# EAGLE design rev1_header_done (EAGLE 9.5.1)
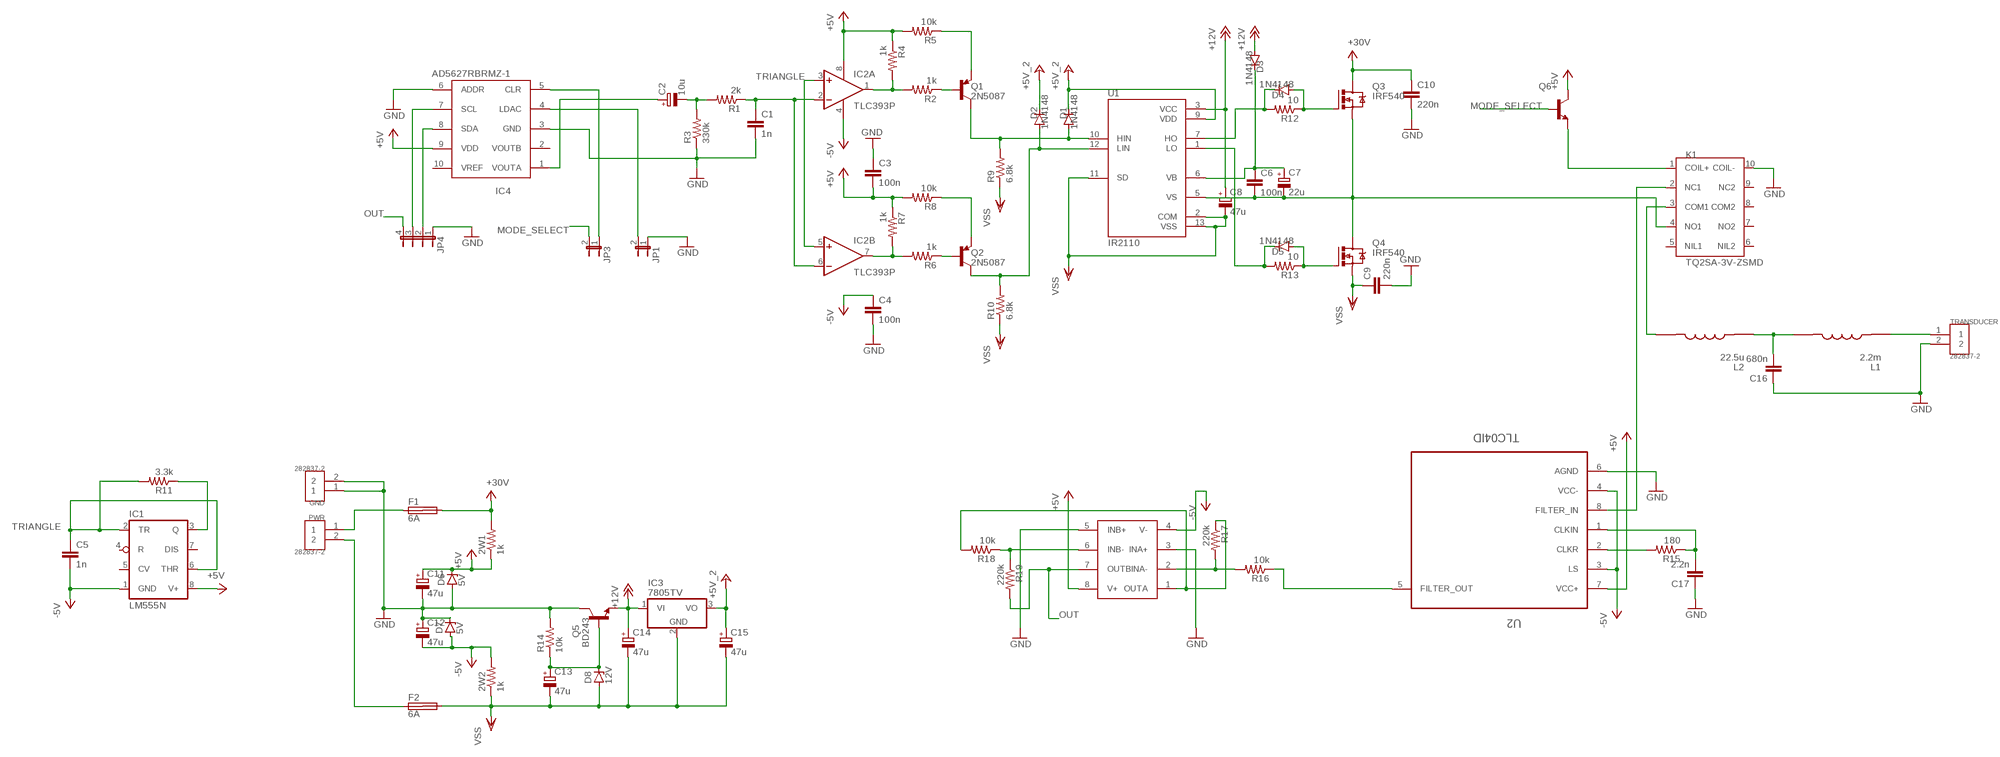
[diagram p0: schematic, sheet 1]

## Parts
2W1  1k  R-US_V235/17  [V235/17]
2W2  1k  R-US_V235/17  [V235/17]
C1  1n  C-EU050-025X075  [C050-025X075]
C2  10u  CPOL-EUE2,5-6E  [E2,5-6E]
C3  100n  C-EU050-025X075  [C050-025X075]
C4  100n  C-EU050-025X075  [C050-025X075]
C5  1n  C-EU050-025X075  [C050-025X075]
C6  100n  C-EU050-025X075  [C050-025X075]
C7  22u  CPOL-EUE2,5-6E  [E2,5-6E]
C8  47u  CPOL-EUE2,5-6E  [E2,5-6E]
C9  220n  C-EU050-025X075  [C050-025X075]
C10  220n  C-EU050-025X075  [C050-025X075]
C11  47u  CPOL-EUE2,5-6E  [E2,5-6E]
C12  47u  CPOL-EUE2,5-6E  [E2,5-6E]
C13  47u  CPOL-EUE2,5-6E  [E2,5-6E]
C14  47u  CPOL-EUE2,5-6E  [E2,5-6E]
C15  47u  CPOL-EUE2,5-6E  [E2,5-6E]
C16  680n  C-EU050-025X075  [C050-025X075]
C17  2.2n  C-EU050-025X075  [C050-025X075]
D1  1N4148  1N4148DO35-7  [DO35-7]
D2  1N4148  1N4148DO35-7  [DO35-7]
D3  1N4148  1N4148DO35-7  [DO35-7]
D4  1N4148  1N4148DO35-7  [DO35-7]
D5  1N4148  1N4148DO35-7  [DO35-7]
D6  5V  1N4728  [DO41Z10]
D7  5V  1N4728  [DO41Z10]
D8  12V  1N4728  [DO41Z10]
F1  6A  SHK20L  [SHK20L]
F2  6A  SHK20L  [SHK20L]
GND  282837-2  [TE_282837-2]
IC1  LM555N  [DIL08]
IC2  TLC393P  [DIL08]
IC3  7805TV  [TO220V]
IC4  AD5627RBRMZ-1  [SOP50P490X110-10N]
IC5  OP2177CRMZ  [SOP65P490X110-8N]
JP1  JP1E  [JP1]
JP3  JP1E  [JP1]
JP4  JP4E  [JP4]
K1  TQ2SA-3V-ZSMD  [TQ2SA-3V-Z]
L1  2.2m  LQH43NN222K03L  [IND_LQH43NN222K03L]
L2  22.5u  LQH43NN222K03L  [IND_LQH43NN222K03L]
PWR  282837-2  [TE_282837-2]
Q1  2N5087  [TO92]
Q2  2N5087  [TO92]
Q3  IRF540  [TO220BV]
Q4  IRF540  [TO220BV]
Q5  BD243  [TO220]
Q6  -NPN-TO92  [TO92]
R1  2k  R-US_V234/12  [V234/12]
R2  1k  R-US_V234/12  [V234/12]
R3  330k  R-US_V234/12  [V234/12]
R4  1k  R-US_V234/12  [V234/12]
R5  10k  R-US_V234/12  [V234/12]
R6  1k  R-US_V234/12  [V234/12]
R7  1k  R-US_V234/12  [V234/12]
R8  10k  R-US_V234/12  [V234/12]
R9  6.8k  R-US_V234/12  [V234/12]
R10  6.8k  R-US_V234/12  [V234/12]
R11  3.3k  R-US_V234/12  [V234/12]
R12  10  R-US_V234/12  [V234/12]
R13  10  R-US_V234/12  [V234/12]
R14  10k  R-US_V234/12  [V234/12]
R15  180  R-US_V234/12  [V234/12]
R16  10k  R-US_V234/12  [V234/12]
R17  220k  R-US_V234/12  [V234/12]
R18  10k  R-US_V234/12  [V234/12]
R19  220k  R-US_V234/12  [V234/12]
TRANSDUCER  282837-2  [TE_282837-2]
U1  IR2110  [DIP762W45P254L2019H533Q14]
U2  TLC04ID  [SOIC127P600X175-8N]

## Nets
+5V: 2W1.1 C3.2 C11.+ D6.C IC1.8(V+) IC2.8(P:V+) IC4.9(VDD) IC5.8(V+) Q6.3(C) R4.1 R5.2 R7.1 R8.2 U2.7(VCC+)
+5V_2: C15.+ D1.C D2.C IC3.3(VO) U1.9(VDD)
+12V: C8.+ C14.+ D3.A IC3.1(VI) Q5.3(E) U1.3(VCC)
-5V: 2W2.2 C4.1 C5.2 C12.- D7.A IC1.1(GND) IC2.4(P:V-) IC5.4(V-) U2.3(LS) U2.4(VCC-)
CLR: IC4.5(CLR) JP3.1
GND: C1.2 C3.1 C4.2 C9.2 C10.2 C11.- C12.+ C16.1 C17.1 D6.A D7.C GND.1 GND.2 IC4.3(GND) IC4.6(ADDR) IC5.3(INA+) IC5.5(INB+) JP1.1 JP4.1 K1.10(COIL-) Q5.2(C) R3.1 R14.2 TRANSDUCER.2 U2.6(AGND)
H_GATE: D4.A Q3.G R12.1
L_GATE: D5.A Q4.G R13.1
LDAC: IC4.4(LDAC) JP1.2
MODE_SELECT: JP3.2 Q6.2(B)
N$1: C2.+ IC4.1(VOUTA)
N$2: C2.- R1.2 R3.2
N$3: C1.1 IC2.2(A:-IN) IC2.6(B:-IN) R1.1
N$4: IC2.1(A:OUT) R2.2 R4.2
N$5: Q1.2(B) R2.1
N$6: Q1.3(E) R5.1
N$7: IC2.7(B:OUT) R6.2 R7.2
N$8: Q2.3(E) R8.1
N$9: Q2.2(B) R6.1
N$10: D1.A Q1.1(C) R9.2 U1.10(HIN)
N$11: D2.A Q2.1(C) R10.2 U1.12(LIN)
N$12: IC1.3(Q) R11.1
N$13: C6.1 C7.+ D3.C U1.6(VB)
N$16: C16.2 L1.2 L2.1
N$17: D4.C R12.2 U1.7(HO)
N$20: D5.C R13.2 U1.1(LO)
N$21: K1.3(COM1) L2.2
N$22: K1.1(COIL+) Q6.1(E)
N$24: L1.1 TRANSDUCER.1
N$25: F1.1A PWR.1
N$26: F2.1A PWR.2
N$28: C13.+ D8.C Q5.1(B) R14.1
N$29: K1.2(NC1) U2.8(FILTER_IN)
N$31: R15.2 U2.2(CLKR)
N$32: C17.2 R15.1 U2.1(CLKIN)
N$33: R16.1 U2.5(FILTER_OUT)
N$34: IC5.2(INA-) R16.2 R17.2
N$35: IC5.1(OUTA) R17.1 R18.2
N$36: IC5.6(INB-) R18.1 R19.1
OUT: IC5.7(OUTB) JP4.4 R19.2
SCL: IC4.7(SCL) JP4.3
SDA: IC4.8(SDA) JP4.2
TRANSMIT: C6.2 C7.- K1.4(NO1) Q3.S Q4.D U1.5(VS)
TRIANGLE: C5.1 IC1.2(TR) IC1.6(THR) IC2.3(A:+IN) IC2.5(B:+IN) R11.2
V+: 2W1.2 C10.1 F1.2A Q3.D ; supply symbol labelled +30V
VSS: 2W2.1 C8.- C9.1 C13.- C14.- C15.- D8.A F2.2A IC3.2(GND) Q4.S R9.1 R10.1 U1.2(COM) U1.11(SD) U1.13(VSS)
Unconnected: F1.1B F1.2B F2.1B F2.2B IC1.4(R) IC1.5(CV) IC1.7(DIS) IC4.2(VOUTB) IC4.10(VREF) K1.5(NIL1) K1.6(NIL2) K1.7(NO2) K1.8(COM2) K1.9(NC2)

## Library data of the parts
2W1 2W2 R1-R19 = rcl:R-US_: RESISTOR, American symbol; SPICEPREFIX: R
C1 C3-C6 C9 C10 C16 C17 = rcl:C-EU: CAPACITOR, European symbol; SPICEPREFIX: C
C2 C7 C8 C11-C15 = rcl:CPOL-EU: POLARIZED CAPACITOR, European symbol; SPICEPREFIX: C
D1-D5 = diode:1N4148: DIODE high speed (Philips)
D6-D8 = diode:1N4728: Z DIODE 3.3 V, 1W, 5 percent
F1 F2 = fuse:SHK20L: FUSE HOLDER 5 x 20 mm, SH contact, SHH1 Schukat, E1073 Buerklin; OC_FARNELL: unknown; OC_NEWARK: unknown
GND PWR TRANSDUCER = 282837-2:282837-2: TERM BLOCK 5.08MM 2POS SIDE ENTY; AVAILABILITY: Unavailable; COMMENT: 282837-2; DESCRIPTION: Connector Terminal Blocks Receptacle 2 Position 5.08mm Solder Straight Thru-Hole 13.5A/Contact; MF: TE Connectivity; MP: 282837-2; PACKAGE: None; PRICE: None; TE_PURCHASE_URL: https://www.te.com/usa-en/product-282837-2.html?te_bu=Cor&te_type=disp&te_campaign=seda_glo_cor-seda-global-disp-prtnr-fy19-seda-model-bom-cta_sma-317_1&elqCampaignId=32493
IC1 = linear:*555: TIMER
IC2 = linear:TLC393: COMPARATOR
IC3 = linear:78*: Positive VOLTAGE REGULATOR Source: http://cache.national.com/ds/LM/LM78L05.pdf http://www.fairchildsemi.com/ds/LM/LM7805.pdf
IC4 = SOP50P490X110-10N:AD5627RBRMZ-1
IC5 = OP2177CRMZ:OP2177CRMZ
JP1 JP3 = jumper:JP1E: JUMPER
JP4 = jumper:JP4E: JUMPER
K1 = TQ2SA-3V-Z:TQ2SA-3V-Z: 5mm Low profile, 2 Form C relay
L1 L2 = LQH43NN222K03L:LQH43NN222K03L: Inductor Power Chip Unshielded Wirewound 2200uH 5% 1KHz 40Q-Factor Ferrite 0.03A 36.72Ohm DCR 1812 Automotive T/R; AVAILABILITY: Unavailable; DESCRIPTION: Inductor with Inductance: 2200uH Tol. +/-10%, Package: 1812 _4532_; MF: Murata; MP: LQH43NN222K03L; PACKAGE: NONSTANDARD; PRICE: None
Q1 Q2 = transistor-pnp:2N5087: PNP Transistor
Q3 Q4 = transistor-power:IRF540: HEXFET Power MOSFET
Q5 = transistor:BD243: NPN TRANSISTOR Source: Motorola Semiconductor, Master Selection Guide Q3/95 SG73 REV 8 page 5.5-4
Q6 = transistor-neu-to92:*-NPN-: NPN Transistror
U1 = IR2110:IR2110: High and Low Side Driver, All High Voltage Pins On One Side, Separate Logic and Power Ground, Shut-Down; AVAILABILITY: Unavailable; DESCRIPTION: Half-Bridge Gate Driver IC Non-Inverting 14-DIP; MF: Infineon; MP: IR2110; PACKAGE: DIP-14 Infineon; PRICE: None
U2 = TLC04ID:TLC04ID: SWITCHED-CAPACITOR FILTERS; AVAILABILITY: Unavailable; DESCRIPTION: Active Filter Single SW-CAP Low Pass 4th Order 40kHz 8-Pin SOIC Tube; MF: Texas Instruments; MP: TLC04ID; PACKAGE: SOIC-8 Texas Instruments; PRICE: None

## Board
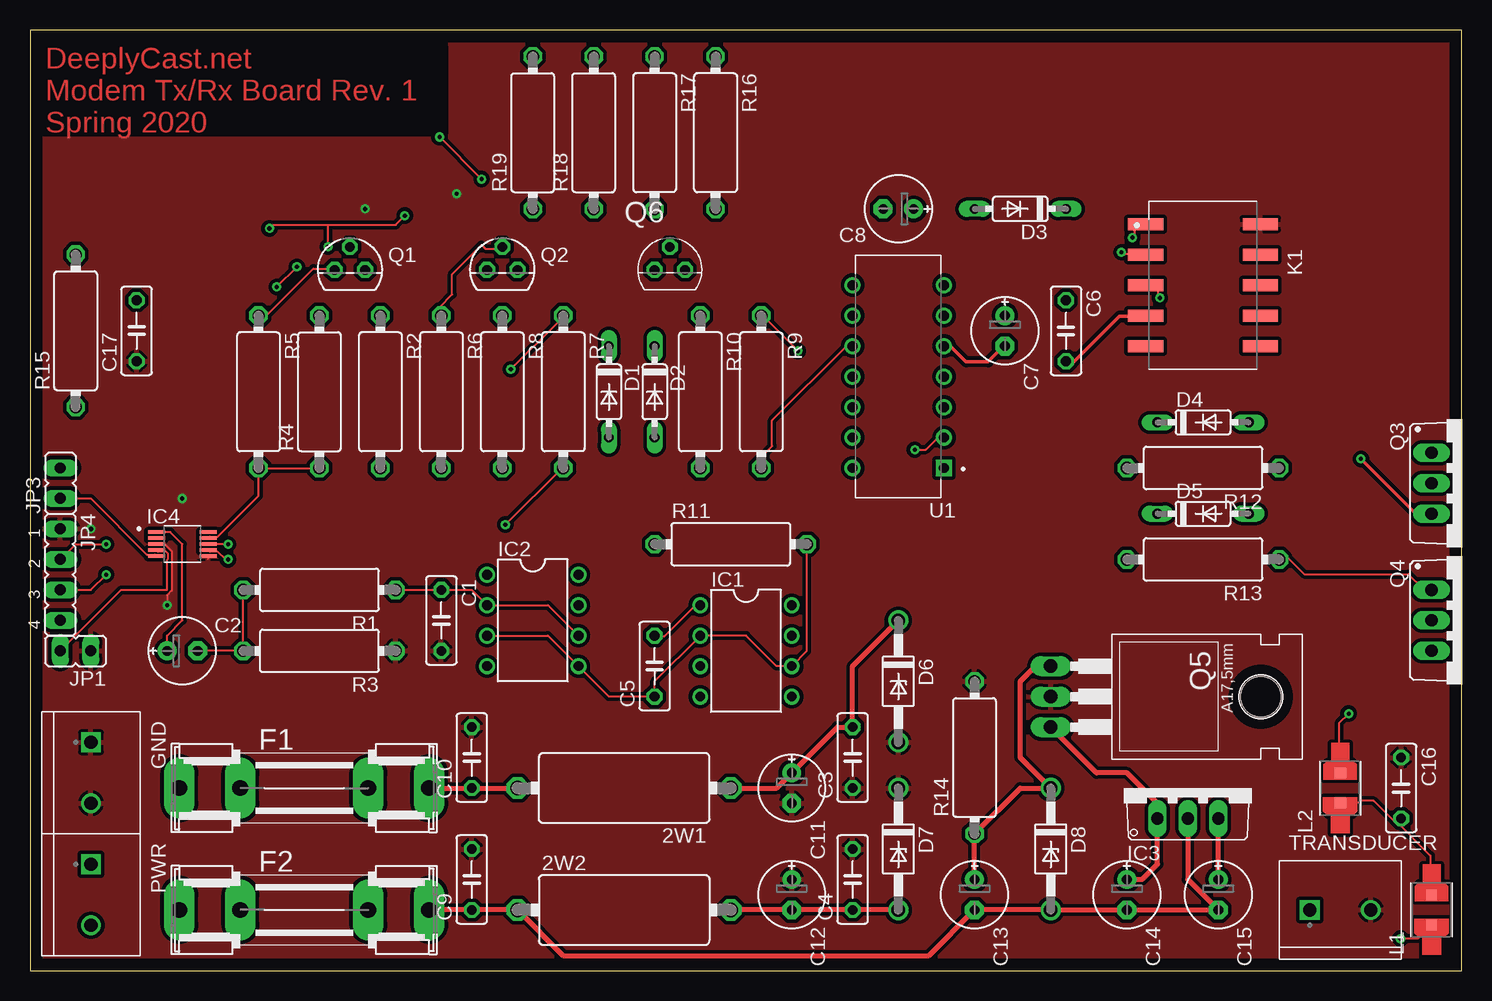
[diagram p1: board, top side]
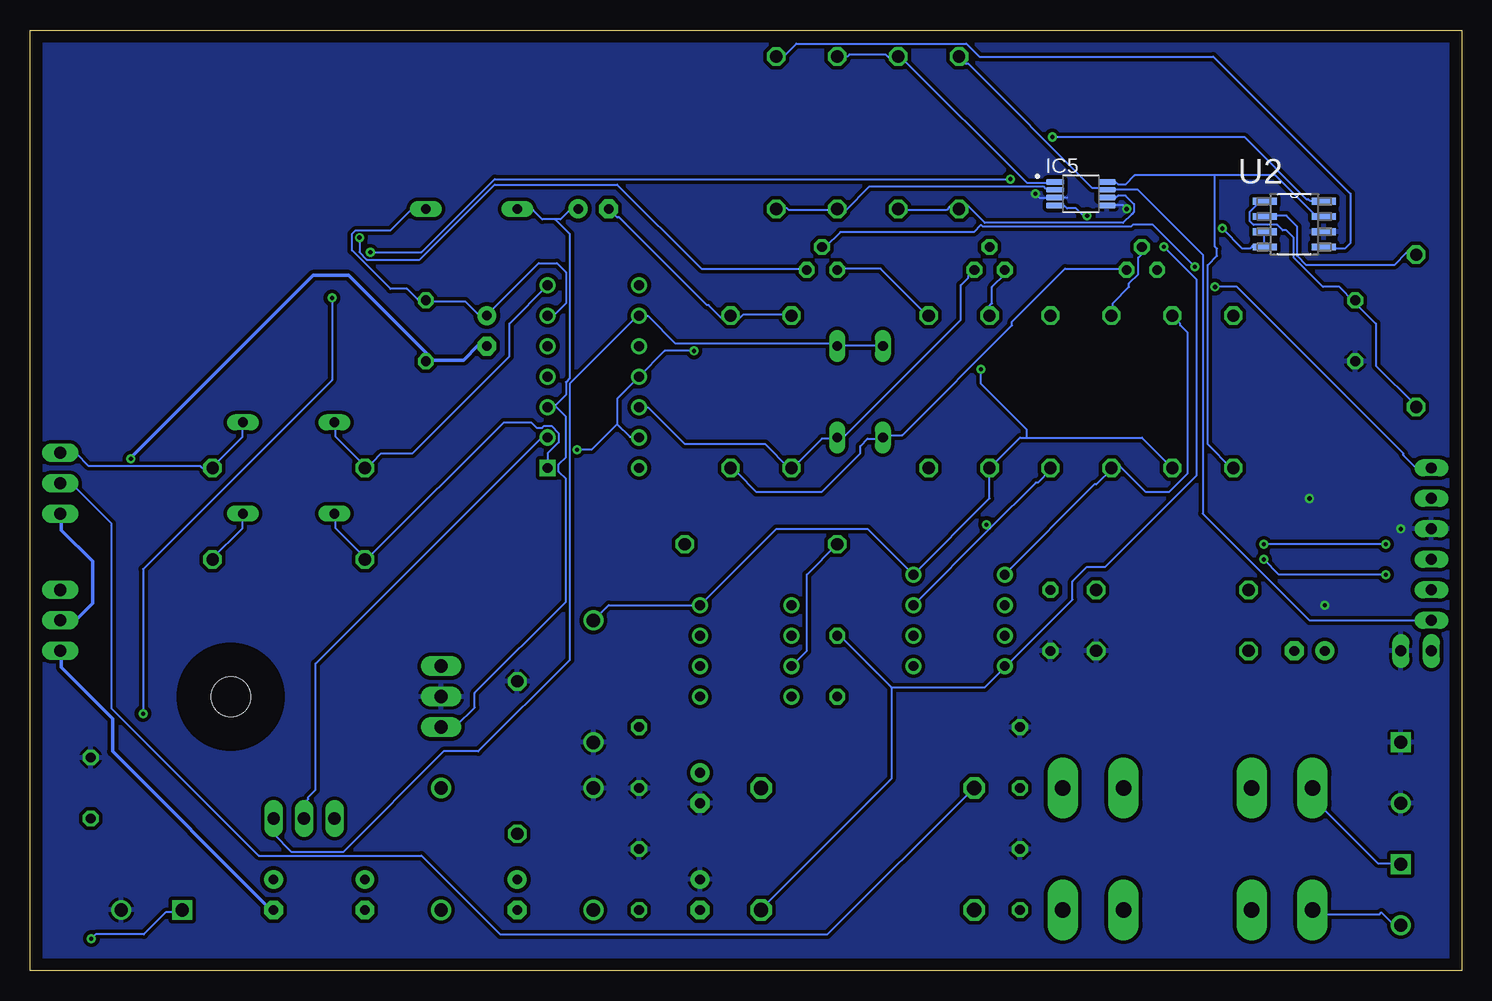
[diagram p2: board, bottom side, seen from below]

Size 119.36 x 78.41 mm. Coordinates in mm from the lower left corner, seen from the top.
Outline: 0,0 119.36,0 119.36,78.41 0,78.41 0,0
Copper layers (1*16): Top 0.035mm / dielectric 1.5mm / Bottom 0.035mm
Design rules "default": minimum track width 6mil, minimum drill 0.35mm, track to track 6mil, track to pad 6mil, pad to pad 6mil, via to via 6mil, smd to smd 6mil, copper to edge 40mil, drill to drill 6mil, minimum pad ring 10mil, minimum via ring 8mil, stop-mask expansion 4mil, vias tented up to drill 0mil, thermal gap 10mil

### Footprints (pad centres in the part's own frame; a part is rotated, then mirrored left to right if it is on the bottom)
V235/17 = drill 1.194 octagon: 1 -8.89,0; 2 8.89,0
C050-025X075 = drill 0.813 octagon: 1 -2.54,0; 2 2.54,0
E2,5-6E = drill 0.813 pad 1.575: + -1.27,0 | drill 0.813 pad 1.575 octagon: - 1.27,0
DO35-7 = drill 0.813 long: A 3.81,0; C -3.81,0
DO41Z10 = drill 1.118: A 5.08,0; C -5.08,0
SHK20L = drill 1.321 pad 2.54 long: 1A -10.414,0; 1B -5.334,0; 2A 10.414,0; 2B 5.334,0
TE_282837-2 = drill 1.1 square: 1 -2.54,0 | drill 1.1: 2 2.54,0
DIL08 = drill 0.813 pad 1.27: 1 -3.81,-3.81; 2 -1.27,-3.81; 3 1.27,-3.81; 4 3.81,-3.81; 5 3.81,3.81; 6 1.27,3.81; 7 -1.27,3.81; 8 -3.81,3.81
TO220V = drill 1.016 long: 1 -2.54,-2.54; 2 0,-2.54; 3 2.54,-2.54
SOP50P490X110-10N = smd 1.47 x 0.28: 1 -2.15,1; 2 -2.15,0.5; 3 -2.15,0; 4 -2.15,-0.5; 5 -2.15,-1; 6 2.15,-1; 7 2.15,-0.5; 8 2.15,0; 9 2.15,0.5; 10 2.15,1
SOP65P490X110-8N = smd 1.47 x 0.48: 1 -2.15,0.975; 2 -2.15,0.325; 3 -2.15,-0.325; 4 -2.15,-0.975; 5 2.15,-0.975; 6 2.15,-0.325; 7 2.15,0.325; 8 2.15,0.975
JP1 = drill 0.914 long: 1 0,-1.27; 2 0,1.27
JP4 = drill 0.914 long: 1 -3.81,0; 2 -1.27,0; 3 1.27,0; 4 3.81,0
TQ2SA-3V-Z = smd 1 x 2.94: 1 -5.08,-4.78; 2 -2.54,-4.78; 3 0,-4.78; 4 2.54,-4.78; 5 5.08,-4.78; 6 5.08,4.78; 7 2.54,4.78; 8 0,4.78; 9 -2.54,4.78; 10 -5.08,4.78
IND_LQH43NN222K03L = smd 0.9 x 0.9: 1 -1.25,0; 2 1.25,0
TO92 = drill 0.813 octagon: 1 1.27,0; 2 0,1.905; 3 -1.27,0
TO220BV = drill 1.016 long: D 0,-2.54; G -2.54,-2.54; S 2.54,-2.54
TO220 = drill 1.118 long: 1 -2.54,-6.35; 2 0,-6.35; 3 2.54,-6.35 | hole 3.302: 0,11.176
V234/12 = drill 1.016 octagon: 1 -6.35,0; 2 6.35,0
DIP762W45P254L2019H533Q14 = drill 0.83 pad 1.25 square: 1 -3.81,7.62 | drill 0.83 pad 1.25: 2 -3.81,5.08; 3 -3.81,2.54; 4 -3.81,0; 5 -3.81,-2.54; 6 -3.81,-5.08; 7 -3.81,-7.62; 8 3.81,-7.62; 9 3.81,-5.08; 10 3.81,-2.54; 11 3.81,0; 12 3.81,2.54; 13 3.81,5.08; 14 3.81,7.62
SOIC127P600X175-8N = smd 1.981 x 0.559: 1 -2.464,1.905; 2 -2.464,0.635; 3 -2.464,-0.635; 4 -2.464,-1.905; 5 2.464,-1.905; 6 2.464,-0.635; 7 2.464,0.635; 8 2.464,1.905

### Placement (x,y rotation side)
2W1  49.53,15.24 180 top
2W2  49.53,5.08 0 top
C1  34.29,29.21 270 top
C2  12.7,26.67 0 top
C3  68.58,17.78 90 top
C4  68.58,7.62 90 top
C5  52.07,25.4 90 top
C6  86.36,53.34 270 top
C7  81.28,53.34 270 top
C8  72.39,63.5 180 top
C9  36.83,7.62 90 top
C10  36.83,17.78 90 top
C11  63.5,15.24 270 top
C12  63.5,6.35 270 top
C13  78.74,6.35 270 top
C14  91.44,6.35 270 top
C15  99.06,6.35 270 top
C16  114.3,15.24 270 top
C17  8.89,53.34 90 top
D1  48.26,48.26 270 top
D2  52.07,48.26 270 top
D3  82.55,63.5 180 top
D4  97.79,45.72 0 top
D5  97.79,38.1 0 top
D6  72.39,24.13 270 top
D7  72.39,10.16 270 top
D8  85.09,10.16 270 top
F1  22.86,15.24 0 top
F2  22.86,5.08 0 top
GND  5.08,16.51 270 top
IC1  59.69,26.67 270 top
IC2  41.91,29.21 270 top
IC3  96.52,15.24 0 top
IC4  12.7,35.56 0 top
IC5  31.75,64.77 0 bottom
JP1  3.81,26.67 90 top
JP3  2.54,40.64 0 top
JP4  2.54,33.02 270 top
K1  97.79,57.15 270 top
L1  116.84,5.08 90 top
L2  109.22,15.24 90 top
PWR  5.08,6.35 270 top
Q1  26.67,58.42 0 top
Q2  39.37,58.42 0 top
Q3  119.38,40.64 270 top
Q4  119.38,29.21 270 top
Q5  91.44,22.86 270 top
Q6  53.34,58.42 0 top
R1  24.13,31.75 180 top
R2  29.21,48.26 270 top
R3  24.13,26.67 180 top
R4  24.13,48.26 90 top
R5  19.05,48.26 270 top
R6  34.29,48.26 270 top
R7  44.45,48.26 270 top
R8  39.37,48.26 270 top
R9  60.96,48.26 270 top
R10  55.88,48.26 270 top
R11  58.42,35.56 0 top
R12  97.79,41.91 180 top
R13  97.79,34.29 180 top
R14  78.74,17.78 90 top
R15  3.81,53.34 90 top
R16  57.15,69.85 270 top
R17  52.07,69.85 270 top
R18  46.99,69.85 90 top
R19  41.91,69.85 90 top
TRANSDUCER  109.22,5.08 0 top
U1  72.39,49.53 180 top
U2  13.97,62.23 0 bottom

### Tracks (layer width: path | path; a pad name or v marks a point on that pad's centre or on a via)
+5V  (via drill 0.35)
  Top 0.152: R4.1 R5.2 19.05,39.58 15.66,36.19 14.98,36.19 IC4.9 | v40.08,50.14 44.04,54.1 44.04,54.25 44.35,54.56 R7.1
  Top 0.406: 2W1.1 62.23,15.24 C11.+ 67.31,20.32 C3.2 68.58,25.4 D6.C
  Bottom 0.152: D6.C 71.12,30.48 IC1.8 57.15,36.83 49.53,36.83 IC2.8 39.37,39.37 R8.2 36.83,44.45 36.27,44.45 | 36.27,44.45 26.67,44.45 R4.1 | 20.57,66.29 15.54,66.29 12.19,62.94 11.58,62.94 U2.7 | 20.57,66.29 27.28,66.29 28.04,65.53 28.65,65.53 28.8,65.68 29.57,65.68 IC5.8 | Q6.3 51.97,58.52 48.46,58.52 44.5,54.56 R7.1 | v40.08,50.14 40.08,48.92 36.27,45.11 36.27,44.45 | 20.57,66.29 20.57,60.35 20.42,60.2 20.42,59.59 21.18,58.83 21.18,43.89 19.2,41.91 R5.2
+5V_2
  Top 0.406: C15.+ IC3.3
  Bottom 0.152: D1.C 48.31,52.12 51.97,52.12 D2.C 52.27,52.27 65.53,52.27 67.82,54.56 68.58,54.56 U1.9 68.58,54.71 74.37,48.92 74.37,25.91 81.99,18.29 84.89,18.29 93.27,9.91 97.54,9.91 99.06,11.43 IC3.3
+12V
  Top 0.406: C14.+ 92.71,7.62 93.98,8.89 IC3.1 93.98,13.97 91.44,16.51 88.9,16.51 Q5.3
  Bottom 0.152: 75.59,62.64 75.13,62.64 74.37,63.4 73.76,63.4 C8.+ | 75.59,62.64 76.66,62.64 77.42,63.4 78.64,63.4 D3.A | 75.59,47.09 76.2,47.09 U1.3 75.59,47.09 | 75.59,47.09 74.68,48.01 74.68,49.07 74.37,49.38 74.37,61.42 75.59,62.64 | 75.59,47.09 74.68,46.18 74.68,42.82 75.29,42.22 75.29,41.6 74.68,41 74.68,30.79 82.3,23.16 82.3,21.95 83.82,20.42 85.04,20.42 Q5.3
-5V  (via drill 0.35)
  Top 0.152: v31.24,62.94 30.48,62.18 24.84,62.18 | 24.84,62.18 20.27,62.18 v19.96,61.87 | IC1.1 55.47,30.48 52.88,27.89 52.12,27.89 C5.2 | v24.84,60.35 24.84,62.18
  Top 0.406: 2W2.2 C12.- C4.1 D7.A
  Bottom 0.152: v31.24,62.94 31.55,62.94 32.16,63.55 32.92,63.55 33.07,63.7 33.83,63.7 IC5.4 | v19.96,61.87 18.29,60.2 17.68,60.2 17.37,60.5 16.61,60.5 16.46,60.35 | 16.46,60.35 16.46,61.57 U2.3 | 16.46,60.35 U2.4 | 38.1,25.3 39.78,23.62 47.55,23.62 | 47.55,23.62 51.97,28.04 C5.2 | 47.55,23.62 47.55,16 58.37,5.18 2W2.2 | v24.84,60.35 22.1,57.61 22.1,41.3 29.72,33.68 31.24,33.68 32.46,32.46 32.46,30.94 38.1,25.3 | 38.1,25.3 IC2.4
CLR
  Top 0.152: IC4.5 10.42,34.69 9.74,34.69 5.06,39.37 JP3.1
GND  (via drill 0.35)
  Top 0.152: IC4.6 14.94,34.44 14.85,34.34 | IC4.3 10.67,35.51 11.28,35.51 11.82,34.97 11.82,31.71 11.43,31.32 v11.43,30.48
  Bottom 0.152: 32.89,64.44 33.07,64.47 33.83,64.47 IC5.3 35.23,64.44 v35.56,64.77 | v27.94,63.5 28.23,63.8 IC5.5
  other vias: 5.08,36.83 12.7,39.37
  pour Top (isolate 0.305): 0,0 119.38,0 119.38,77.47 119.38,78.74 0,78.74
  pour Bottom (isolate 0.305): 0,77.47 0,78.74 119.38,78.74 119.38,0 0,0
H_GATE
  Bottom 0.152: 104.24,41.91 101.65,44.5 101.65,45.72 D4.A | 104.24,41.91 104.39,41.76 104.85,41.76 105.16,42.06 114.45,42.06 115.52,43.13 116.74,43.13 Q3.G | 104.24,41.91 R12.1
L_GATE
  Top 0.152: Q4.G 116.74,31.85 116.13,31.85 114.91,33.07 106.22,33.07 104.85,34.44 104.39,34.44 104.24,34.29 R13.1
  Bottom 0.152: D5.A 101.65,38.1 101.65,36.88 104.24,34.29 R13.1
LDAC
  Top 0.152: JP1.2 7.62,31.75 11.43,31.75 11.43,33.02 11.43,34.26 11.51,34.35 11.51,34.77 11.36,34.93 10.68,34.93 IC4.4
MODE_SELECT  (via drill 0.35)
  Top 0.152: v20.57,57 v22.25,58.67
  Bottom 0.152: v22.25,58.67 25.76,62.18 27.43,62.18 27.58,62.03 39.93,62.03 40.08,62.18 40.69,61.57 51.82,61.57 53.03,60.35 53.34,60.35 Q6.2 | v20.57,57 18.75,57 4.88,43.13 4.88,42.98 3.81,41.91 JP3.2
N$1
  Top 0.152: C2.+ 11.43,27.94 12.7,29.21 12.7,35.56 11.7,36.56 IC4.1
N$2
  Top 0.152: C2.- R3.2 R1.2
N$3
  Top 0.152: R1.1 C1.1 36.83,31.75 IC2.2 43.18,30.48 IC2.6
N$4
  Bottom 0.152: 29.11,41.91 30.48,40.54 30.63,40.54 38.1,33.07 IC2.1 | R4.2 23.47,53.95 23.47,53.8 22.86,53.19 22.86,41.45 24.38,39.93 26.36,39.93 28.5,42.06 28.96,42.06 29.11,41.91 | 29.11,41.91 R2.2
N$5
  Bottom 0.152: Q1.2 26.67,59.74 26.98,59.44 26.98,58.06 27.74,57.3 27.74,57 29.11,55.63 29.11,54.71 R2.1
N$6
  Top 0.152: Q1.3 25.3,58.52 23.62,58.52 19.81,54.71 19.05,54.71 R5.1
N$7  (via drill 0.35)
  Top 0.152: v39.62,37.19 44.35,41.91 R7.2
  Bottom 0.152: 39.32,36.88 35.51,40.69 35.36,40.69 34.29,41.76 R6.2 | 39.32,36.88 IC2.7 | 39.32,36.88 v39.62,37.19
N$8
  Bottom 0.152: Q2.3 38.1,58.06 39.17,57 39.17,55.63 39.47,55.32 39.47,54.71 R8.1
N$9
  Top 0.152: Q2.2 39.32,60.2 37.95,60.2 37.64,60.5 35.2,58.06 35.2,56.39 34.14,55.32 34.14,54.86 34.29,54.71 R6.1
N$10
  Top 0.152: R9.2 60.81,42.06 60.81,42.67 61.87,43.74 61.87,45.87 67.97,51.97 68.58,51.97 U1.10
  Bottom 0.152: R9.2 60.5,41.45 60.35,41.45 58.83,39.93 53.34,39.93 50.14,43.13 50.14,43.74 49.53,44.35 48.31,44.35 D1.A 48.16,44.5 48.01,44.65 46.63,44.65 37.49,53.8 37.49,54.1 33.07,58.52 28.04,58.52 Q1.1
N$11
  Bottom 0.152: U1.12 68.58,46.94 67.82,46.94 64.77,43.89 58.06,43.89 56.08,41.91 R10.2 55.78,41.91 53.34,44.35 52.12,44.35 D2.A 51.97,44.5 51.51,44.5 41.76,54.25 41.76,57.15 41.15,57.76 41.15,57.91 Q2.1
N$12
  Bottom 0.152: IC1.3 54.61,26.67 54.61,33.02 R11.1
N$13
  Bottom 0.152: D3.C 86.41,63.4 87.63,63.4 89.31,61.72 92.2,61.72 92.51,61.42 92.51,60.05 89.31,56.84 87.94,56.84 87.02,55.93 86.41,55.93 C6.1 86.26,55.78 83.06,55.78 81.99,54.71 81.38,54.71 C7.+ 81.23,54.71 76.96,58.98 75.44,58.98 74.68,58.22 74.68,55.63 75.59,54.71 76.2,54.71 U1.6
N$16
  Top 0.152: 113.84,12.5 114.15,12.5 114.3,12.65 C16.2 113.84,12.5 | 113.84,12.5 113.69,12.5 112.01,14.17 110.95,14.17 110.8,14.02 109.27,14.02 L2.1 | 113.84,12.5 116.74,9.6 116.74,6.4 L1.2
N$17
  Bottom 0.152: D4.C 93.88,45.72 93.88,44.5 91.44,42.06 R12.2 90.98,42.37 90.83,42.37 90.07,43.13 87.48,43.13 79.4,51.21 79.4,53.95 U1.7
N$20
  Bottom 0.152: D5.C 93.88,38.1 93.88,36.88 91.44,34.44 R13.2 90.98,34.75 90.83,34.75 79.86,45.72 77.57,45.72 77.11,45.26 76.66,45.26 76.5,45.41 75.89,45.41 75.29,44.81 75.29,44.04 76.2,43.13 U1.1
N$21  (via drill 0.35)
  Top 0.152: v109.93,21.44 109.12,20.62 109.12,16.61 L2.2 | v94.18,56.08 94.03,56.24 94.03,56.69 93.57,57.15 K1.3
  Bottom 0.152: v109.93,21.44 109.93,33.48 94.18,49.23 v94.18,56.08
N$22  (via drill 0.35)
  Top 0.152: v91.9,61.11 92.05,61.27 92.05,61.72 92.51,62.18 92.96,62.18 K1.1
  Bottom 0.152: v91.9,61.11 91.9,59.89 91.29,59.28 86.87,59.28 80.62,65.53 70.41,65.53 63.4,58.52 54.71,58.52 Q6.1
N$24  (via drill 0.35)
  Top 0.152: L1.1 115.7,2.69 v114.25,2.69
  Bottom 0.152: v114.25,2.69 113.89,3.05 109.88,3.05 108.05,4.88 106.83,4.88 106.68,5.03 TRANSDUCER.1
N$25
  Bottom 0.152: PWR.1 5.18,8.99 7.01,8.99 12.34,14.33 12.34,15.24 F1.1A
N$26
  Bottom 0.152: PWR.2 5.64,3.81 6.71,4.88 6.86,4.72 12.04,4.72 12.34,5.03 F2.1A
N$28
  Top 0.406: C13.+ R14.1 82.55,15.24 D8.C 82.55,17.78 82.55,24.13 83.82,25.4 Q5.1
N$29  (via drill 0.35)
  Top 0.152: v37.64,65.99 v34.14,69.49 | v90.98,59.89 91.14,59.74 92.96,59.74 K1.2
  Bottom 0.152: v34.14,69.49 18.14,69.49 12.95,64.31 12.8,64.31 12.65,64.16 11.58,64.16 U2.8 | v37.64,65.99 80.62,65.99 86.72,59.89 v90.98,59.89
N$31
  Bottom 0.152: U2.2 16.31,62.94 14.63,62.94 13.72,62.03 13.72,59.59 12.95,58.83 5.64,58.83 4.57,59.89 3.96,59.89 3.81,59.74 R15.2
N$32
  Bottom 0.152: 8.99,55.78 10.21,57 11.58,57 14.02,59.44 14.02,61.11 14.63,61.72 14.94,61.72 15.39,62.18 17.37,62.18 17.68,62.48 17.68,63.25 16.92,64.01 16.46,64.01 U2.1 | 8.99,55.78 7.16,53.95 7.16,50.44 3.81,47.09 R15.1 | 8.99,55.78 C17.2
N$33
  Bottom 0.152: R16.1 56.54,76.2 55.47,77.27 41.3,77.27 40.23,76.2 20.73,76.2 9.3,64.77 9.3,60.66 9.75,60.2 11.43,60.2 U2.5
N$34
  Bottom 0.152: IC5.2 33.98,65.23 34.75,65.23 34.9,65.38 49.38,65.38 51.36,63.4 51.97,63.4 R17.2 52.12,63.4 56.08,63.4 56.24,63.55 57.15,63.55 R16.2
N$35
  Bottom 0.152: IC5.1 33.98,65.68 36.27,65.68 46.79,76.2 R18.2 47.09,76.2 47.24,76.05 47.7,76.05 48.01,76.35 51.05,76.35 51.21,76.2 R17.1
N$36
  Bottom 0.152: 41.76,63.7 41.15,63.7 39.78,62.33 28.25,62.33 27.51,63.07 27.33,63.25 27.33,63.91 28.04,64.62 28.65,64.62 28.8,64.47 29.57,64.47 IC5.6 | 41.76,63.7 41.91,63.55 R19.1 41.76,63.7 | 41.76,63.7 42.67,63.7 42.98,63.4 46.94,63.4 R18.1
OUT
  Bottom 0.152: R19.2 41.3,75.59 41.15,75.59 30.79,65.23 29.72,65.23 IC5.7 27,65.09 21.59,59.69 21.59,38.1 12.7,29.21 JP4.4
SCL  (via drill 0.35)
  Top 0.152: JP4.3 5.08,31.75 v6.35,33.02 | IC4.7 14.98,34.93 15.66,34.93 16.3,34.29 v16.51,34.29
  Bottom 0.152: v6.35,33.02 15.24,33.02 v16.51,34.29
SDA  (via drill 0.35)
  Top 0.152: JP4.2 3.81,35.56 v6.35,35.56 | v16.51,35.56 IC4.8
  Bottom 0.152: v6.35,35.56 v16.51,35.56
TRANSMIT  (via drill 0.35)
  Top 0.152: 76.2,51.97 U1.5 | 81.23,52.12 C7.- | 87.02,50.75 86.41,50.75 C6.2 | 92.96,54.56 K1.4
  Top 0.305: 76.2,51.97 76.81,51.97 78.03,50.75 79.86,50.75 81.23,52.12 | 92.96,54.56 90.83,54.56 87.02,50.75 | Q3.S 115.52,38.1 v110.95,42.67
  Bottom 0.152: 116.74,29.26 Q4.D | 116.74,38.1 Q3.S | 86.26,50.9 C6.2 | 81.38,52.12 C7.-
  Bottom 0.305: 116.74,29.26 115.52,29.26 114.15,30.63 114.15,34.14 116.74,36.73 116.74,38.1 | 86.26,50.9 83.21,50.9 81.99,52.12 81.38,52.12 | v110.95,42.67 110.95,42.77 95.76,57.96 92.81,57.96 86.36,51.51 C6.2
TRIANGLE
  Top 0.152: IC2.3 43.18,27.94 IC2.5 48.26,22.86 C5.1 52.07,24.13 IC1.2 59.69,27.94 62.23,25.4 IC1.6 64.77,26.67 R11.2
V+
  Top 0.406: F1.2A C10.1 2W1.2
  Bottom 0.152: 2W1.2 40.69,15.24 52.88,3.05 80.16,3.05 86.72,9.6 100.28,9.6 112.57,21.89 112.57,37.29 115.82,40.54 116.74,40.54 Q3.D
VSS  (via drill 0.35)
  Top 0.152: v73.76,43.43 74.68,43.43 75.59,44.35 76.2,44.35 U1.2 | v64.01,51.66 60.96,54.71 R9.1 | C9.1 36.88,5.18 36.88,5.08
  Top 0.406: F2.2A C9.1 36.88,5.08 2W2.1 44.45,1.27 74.93,1.27 C13.- D8.A C14.- C15.- 96.52,7.62 IC3.2
  Bottom 0.152: 70.41,45.57 69.34,44.5 68.58,44.5 U1.13 | 70.41,45.57 70.41,47.7 U1.11 66.45,51.66 v64.01,51.66 | v73.76,43.43 72.54,43.43 70.41,45.57 | 60.81,54.41 60.2,54.41 59.89,54.71 55.93,54.71 R10.1 | 60.81,54.41 60.96,54.56 R9.1 60.81,54.41 | C8.- 70.41,62.79 70.26,62.79 62.94,55.47 62.79,55.47 61.72,54.41 60.81,54.41 | 99.36,5.18 99.06,5.18 C15.- | 116.74,26.67 Q4.S | U1.2 76.2,44.35 76.81,44.35 95.56,25.6 95.56,15.09 96.16,14.48 96.16,14.33 96.47,14.02 96.47,12.8 IC3.2
  Bottom 0.305: 99.36,5.18 112.47,18.29 112.47,21.03 116.74,25.3 116.74,26.67

### Text on the board
Top: DeeplyCast.net / Modem Tx/Rx Board Rev. 1 / Spring 2020